# EAGLE schematic hashing.board (EAGLE 6.5.0)

## Sheet 1 of 4
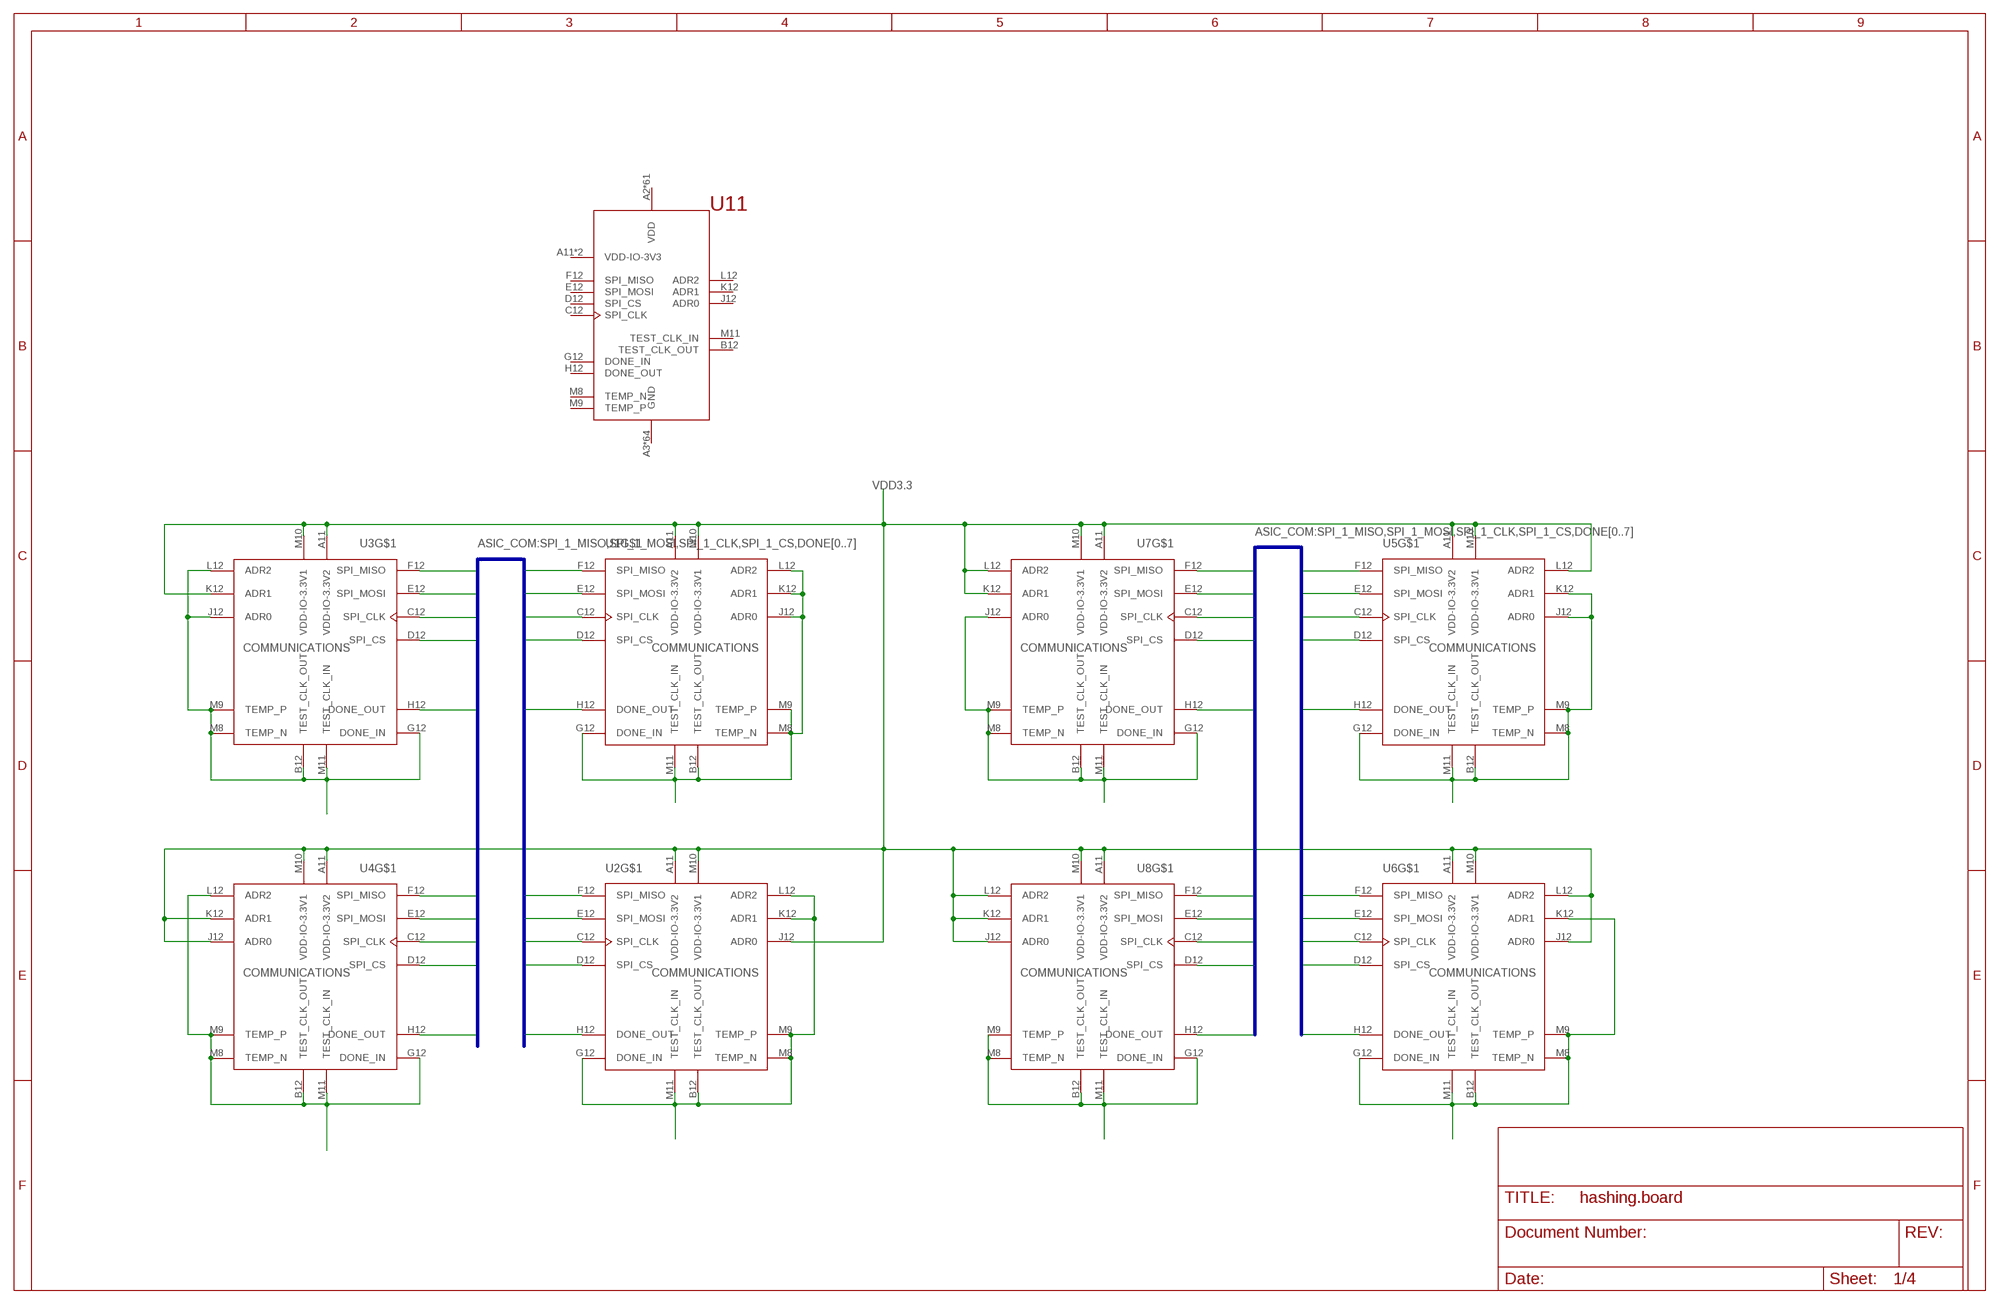
[diagram p0: schematic, sheet 1]

### Parts
U1  ASIC-1  [BGA-144-0.8MM]
U2  ASIC-1  [BGA-144-0.8MM]
U3  ASIC-1  [BGA-144-0.8MM]
U4  ASIC-1  [BGA-144-0.8MM]
U5  ASIC-1  [BGA-144-0.8MM]
U6  ASIC-1  [BGA-144-0.8MM]
U7  ASIC-1  [BGA-144-0.8MM]
U8  ASIC-1  [BGA-144-0.8MM]
U11  BFL-ASIC-1  [BFL-BGA-BIG-PADS]

### Nets
DONE0: U1.H12(DONE_OUT) ; also sheet 2
DONE1: U2.H12(DONE_OUT) ; also sheet 2
DONE2: U3.H12(DONE_OUT) ; also sheet 2
DONE3: U4.H12(DONE_OUT) ; also sheet 2
DONE4: U5.H12(DONE_OUT) ; also sheet 2
DONE5: U6.H12(DONE_OUT) ; also sheet 2
DONE6: U7.H12(DONE_OUT) ; also sheet 2
DONE7: U8.H12(DONE_OUT) ; also sheet 2
GND: U1.B12(TEST_CLK_OUT) U1.G12(DONE_IN) U1.J12(ADR0) U1.K12(ADR1) U1.L12(ADR2) U1.M8(TEMP_N) U1.M9(TEMP_P) U1.M11(TEST_CLK_IN) U2.B12(TEST_CLK_OUT) U2.G12(DONE_IN) U2.K12(ADR1) U2.L12(ADR2) U2.M8(TEMP_N) U2.M9(TEMP_P) U2.M11(TEST_CLK_IN) U3.B12(TEST_CLK_OUT) U3.G12(DONE_IN) U3.J12(ADR0) U3.L12(ADR2) U3.M8(TEMP_N) U3.M9(TEMP_P) U3.M11(TEST_CLK_IN) U4.B12(TEST_CLK_OUT) U4.G12(DONE_IN) U4.L12(ADR2) U4.M8(TEMP_N) U4.M9(TEMP_P) U4.M11(TEST_CLK_IN) U5.B12(TEST_CLK_OUT) U5.G12(DONE_IN) U5.J12(ADR0) U5.K12(ADR1) U5.M8(TEMP_N) U5.M9(TEMP_P) U5.M11(TEST_CLK_IN) U6.B12(TEST_CLK_OUT) U6.G12(DONE_IN) U6.K12(ADR1) U6.M8(TEMP_N) U6.M9(TEMP_P) U6.M11(TEST_CLK_IN) U7.B12(TEST_CLK_OUT) U7.G12(DONE_IN) U7.J12(ADR0) U7.M8(TEMP_N) U7.M9(TEMP_P) U7.M11(TEST_CLK_IN) U8.B12(TEST_CLK_OUT) U8.G12(DONE_IN) U8.M8(TEMP_N) U8.M9(TEMP_P) U8.M11(TEST_CLK_IN) ; also sheet 2,3,4
SPI_1_CLK: U1.C12(SPI_CLK) U2.C12(SPI_CLK) U3.C12(SPI_CLK) U4.C12(SPI_CLK) U5.C12(SPI_CLK) U6.C12(SPI_CLK) U7.C12(SPI_CLK) U8.C12(SPI_CLK) ; also sheet 2
SPI_1_CS: U1.D12(SPI_CS) U2.D12(SPI_CS) U3.D12(SPI_CS) U4.D12(SPI_CS) U5.D12(SPI_CS) U6.D12(SPI_CS) U7.D12(SPI_CS) U8.D12(SPI_CS) ; also sheet 2
SPI_1_MISO: U1.F12(SPI_MISO) U2.F12(SPI_MISO) U3.F12(SPI_MISO) U4.F12(SPI_MISO) U5.F12(SPI_MISO) U6.F12(SPI_MISO) U7.F12(SPI_MISO) U8.F12(SPI_MISO) ; also sheet 2
SPI_1_MOSI: U1.E12(SPI_MOSI) U2.E12(SPI_MOSI) U3.E12(SPI_MOSI) U4.E12(SPI_MOSI) U5.E12(SPI_MOSI) U6.E12(SPI_MOSI) U7.E12(SPI_MOSI) U8.E12(SPI_MOSI) ; also sheet 2
VDD3.3: U1.A11(VDD-IO-3.3V2) U1.M10(VDD-IO-3.3V1) U2.A11(VDD-IO-3.3V2) U2.J12(ADR0) U2.M10(VDD-IO-3.3V1) U3.A11(VDD-IO-3.3V2) U3.K12(ADR1) U3.M10(VDD-IO-3.3V1) U4.A11(VDD-IO-3.3V2) U4.J12(ADR0) U4.K12(ADR1) U4.M10(VDD-IO-3.3V1) U5.A11(VDD-IO-3.3V2) U5.L12(ADR2) U5.M10(VDD-IO-3.3V1) U6.A11(VDD-IO-3.3V2) U6.J12(ADR0) U6.L12(ADR2) U6.M10(VDD-IO-3.3V1) U7.A11(VDD-IO-3.3V2) U7.K12(ADR1) U7.L12(ADR2) U7.M10(VDD-IO-3.3V1) U8.A11(VDD-IO-3.3V2) U8.J12(ADR0) U8.K12(ADR1) U8.L12(ADR2) U8.M10(VDD-IO-3.3V1)
Unconnected: U11.B12(TEST_CLK_OUT) U11.C12(SPI_CLK) U11.D12(SPI_CS) U11.E12(SPI_MOSI) U11.F12(SPI_MISO) U11.G12(DONE_IN) U11.H12(DONE_OUT) U11.J12(ADR0) U11.K12(ADR1) U11.L12(ADR2) U11.M8(TEMP_N) U11.M9(TEMP_P) U11.M11(TEST_CLK_IN)

### Buses
ASIC_COM:SPI_1_MISO,SPI_1_MOSI,SPI_1_CLK,SPI_1_CS,DONE[0..7]

## Sheet 2 of 4
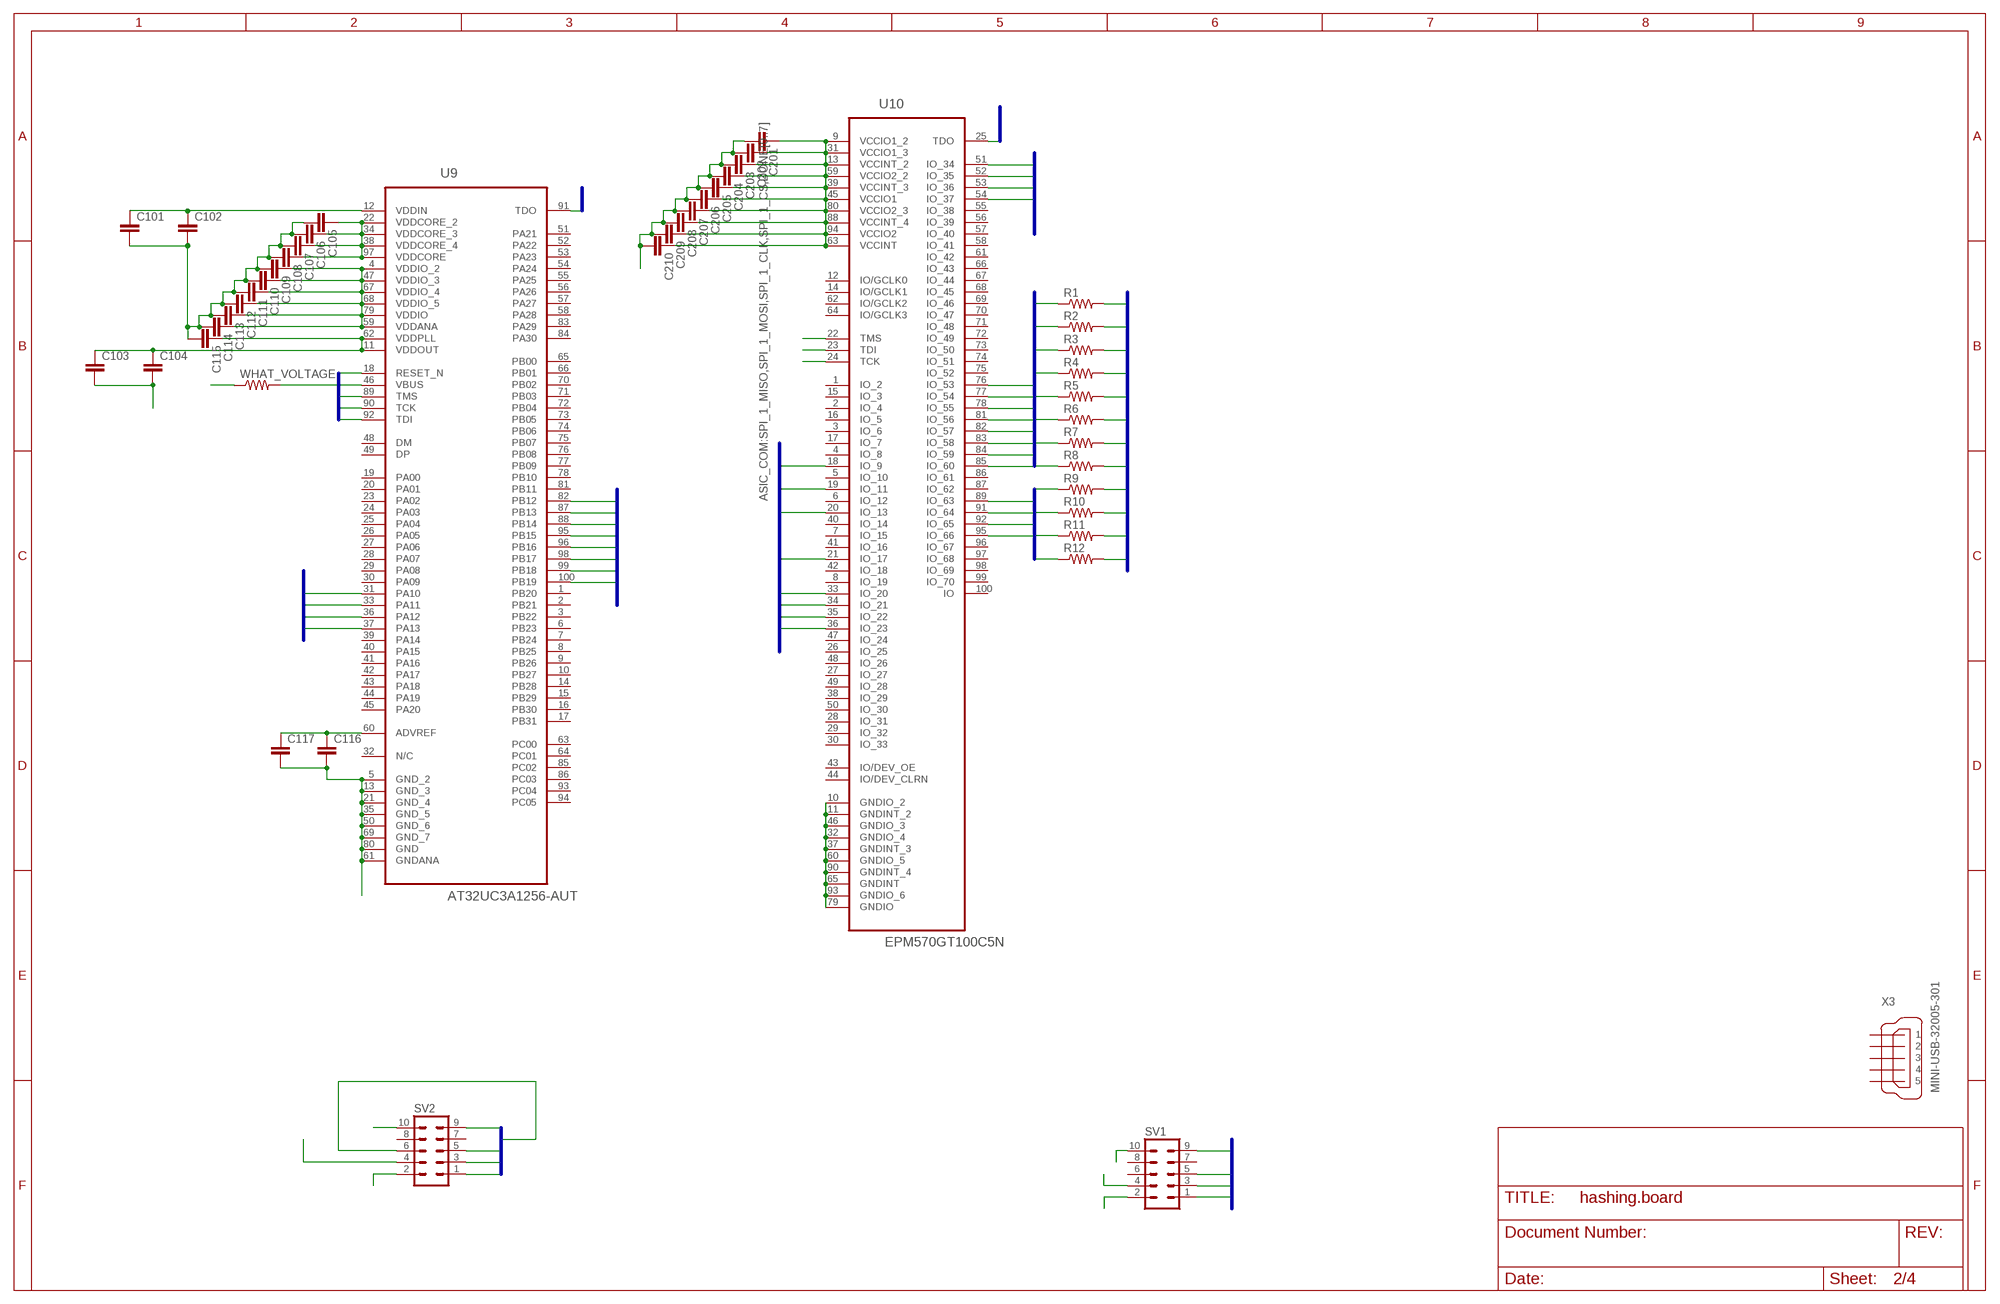
[diagram p1: schematic, sheet 2]

### Parts
C101  C-EUC0402  [C0402]
C102  C-EUC0402  [C0402]
C103  C-EUC0402  [C0402]
C104  C-EUC0402  [C0402]
C105  C-EUC0402  [C0402]
C106  C-EUC0402  [C0402]
C107  C-EUC0402  [C0402]
C108  C-EUC0402  [C0402]
C109  C-EUC0402  [C0402]
C110  C-EUC0402  [C0402]
C111  C-EUC0402  [C0402]
C112  C-EUC0402  [C0402]
C113  C-EUC0402  [C0402]
C114  C-EUC0402  [C0402]
C115  C-EUC0402  [C0402]
C116  C-EUC0402  [C0402]
C117  C-EUC0402  [C0402]
C201  C-EUC0402  [C0402]
C202  C-EUC0402  [C0402]
C203  C-EUC0402  [C0402]
C204  C-EUC0402  [C0402]
C205  C-EUC0402  [C0402]
C206  C-EUC0402  [C0402]
C207  C-EUC0402  [C0402]
C208  C-EUC0402  [C0402]
C209  C-EUC0402  [C0402]
C210  C-EUC0402  [C0402]
R1  R-US_R0201  [R0201]
R2  R-US_R0201  [R0201]
R3  R-US_R0201  [R0201]
R4  R-US_R0201  [R0201]
R5  R-US_R0201  [R0201]
R6  R-US_R0201  [R0201]
R7  R-US_R0201  [R0201]
R8  R-US_R0201  [R0201]
R9  R-US_R0201  [R0201]
R10  R-US_R0201  [R0201]
R11  R-US_R0201  [R0201]
R12  R-US_R0201  [R0201]
SV1  MA05-2  [MA05-2]
SV2  MA05-2  [MA05-2]
U9  AT32UC3A1256-AUT  [QFP50P1600X1600X120-100N]
U10  EPM570GT100C5N  [QFP50P1600X1600X120-100N]
WHAT_VOLTAGE  R-US_R0402  [R0402]
X3  MINI-USB-32005-301  [32005-301]

### Nets
ATMEL_RST: SV2.6 U9.18(RESET_N)
ATMEL_TCK: SV2.1 U9.90(TCK)
ATMEL_TDI: SV2.9 U9.92(TDI)
ATMEL_TDO: SV2.3 U9.91(TDO)
ATMEL_TMS: SV2.5 U9.89(TMS)
CHECK_HERE: WHAT_VOLTAGE.1
CHECK_VOLTAGE: U9.46(VBUS) WHAT_VOLTAGE.2
CPLD_TCK: SV1.1 U10.24(TCK)
CPLD_TDI: SV1.9 U10.23(TDI)
CPLD_TDO: SV1.3 U10.25(TDO)
CPLD_TMS: SV1.5 U10.22(TMS)
DONE0: R1.2 U10.18(IO_9) ; also sheet 1
DONE1: R2.2 U10.19(IO_11) ; also sheet 1
DONE2: R3.2 U10.20(IO_13) ; also sheet 1
DONE3: R4.2 U10.21(IO_17) ; also sheet 1
DONE4: R5.2 U10.51(IO_34) ; also sheet 1
DONE5: R6.2 U10.52(IO_35) ; also sheet 1
DONE6: R7.2 U10.53(IO_36) ; also sheet 1
DONE7: R8.2 U10.54(IO_37) ; also sheet 1
DONE_0: R1.1 U9.82(PB12) U10.76(IO_53)
DONE_1: R2.1 U9.87(PB13) U10.77(IO_54)
DONE_2: R3.1 U9.88(PB14) U10.78(IO_55)
DONE_3: R4.1 U9.95(PB15) U10.81(IO_56)
DONE_4: R5.1 U9.96(PB16) U10.82(IO_57)
DONE_5: R6.1 U9.98(PB17) U10.83(IO_58)
DONE_6: R7.1 U9.99(PB18) U10.84(IO_59)
DONE_7: R8.1 U9.100(PB19) U10.85(IO_60)
GND: C101.2 C102.2 C103.2 C104.2 C105.2 C106.2 C107.2 C108.2 C109.2 C110.2 C111.2 C112.2 C113.2 C114.2 C115.2 C116.2 C117.2 C201.2 C202.2 C203.2 C204.2 C205.2 C206.2 C207.2 C208.2 C209.2 C210.2 SV1.2 SV1.10 SV2.2 SV2.10 U9.5(GND_2) U9.13(GND_3) U9.21(GND_4) U9.35(GND_5) U9.50(GND_6) U9.61(GNDANA) U9.69(GND_7) U9.80(GND) U10.10(GNDIO_2) U10.11(GNDINT_2) U10.32(GNDIO_4) U10.37(GNDINT_3) U10.46(GNDIO_3) U10.60(GNDIO_5) U10.65(GNDINT) U10.79(GNDIO) U10.90(GNDINT_4) U10.93(GNDIO_6) ; also sheet 1,3,4
SPI_1_CLK: R11.2 U10.35(IO_22) ; also sheet 1
SPI_1_CLK_: R11.1 U9.37(PA13) U10.89(IO_63)
SPI_1_CS: R12.2 U10.36(IO_23) ; also sheet 1
SPI_1_CS_: R12.1 U9.31(PA10) U10.95(IO_66)
SPI_1_MISO: R9.2 U10.33(IO_20) ; also sheet 1
SPI_1_MISO_: R9.1 U9.33(PA11) U10.92(IO_65)
SPI_1_MOSI: R10.2 U10.34(IO_21) ; also sheet 1
SPI_1_MOSI_: R10.1 U9.36(PA12) U10.91(IO_64)
VCC+1V8: C103.1 C104.1 C105.1 C106.1 C107.1 C108.1 C115.1 U9.11(VDDOUT) U9.22(VDDCORE_2) U9.34(VDDCORE_3) U9.38(VDDCORE_4) U9.62(VDDPLL) U9.97(VDDCORE)
VCC+3V3: C101.1 C102.1 C109.1 C110.1 C111.1 C112.1 C113.1 C114.1 C116.1 C117.1 C201.1 C202.1 C203.1 C204.1 C205.1 C206.1 C207.1 C208.1 C209.1 C210.1 SV1.4 SV2.4 U9.4(VDDIO_2) U9.12(VDDIN) U9.47(VDDIO_3) U9.59(VDDANA) U9.60(ADVREF) U9.67(VDDIO_4) U9.68(VDDIO_5) U9.79(VDDIO) U10.9(VCCIO1_2) U10.13(VCCINT_2) U10.31(VCCIO1_3) U10.39(VCCINT_3) U10.45(VCCIO1) U10.59(VCCIO2_2) U10.63(VCCINT) U10.80(VCCIO2_3) U10.88(VCCINT_4) U10.94(VCCIO2)
Unconnected: SV1.6 SV1.7 SV1.8 SV2.7 SV2.8 U9.1(PB20) U9.2(PB21) U9.3(PB22) U9.6(PB23) U9.7(PB24) U9.8(PB25) U9.9(PB26) U9.10(PB27) U9.14(PB28) U9.15(PB29) U9.16(PB30) U9.17(PB31) U9.19(PA00) U9.20(PA01) U9.23(PA02) U9.24(PA03) U9.25(PA04) U9.26(PA05) U9.27(PA06) U9.28(PA07) U9.29(PA08) U9.30(PA09) U9.32(N/C) U9.39(PA14) U9.40(PA15) U9.41(PA16) U9.42(PA17) U9.43(PA18) U9.44(PA19) U9.45(PA20) U9.48(DM) U9.49(DP) U9.51(PA21) U9.52(PA22) U9.53(PA23) U9.54(PA24) U9.55(PA25) U9.56(PA26) U9.57(PA27) U9.58(PA28) U9.63(PC00) U9.64(PC01) U9.65(PB00) U9.66(PB01) U9.70(PB02) U9.71(PB03) U9.72(PB04) U9.73(PB05) U9.74(PB06) U9.75(PB07) U9.76(PB08) U9.77(PB09) U9.78(PB10) U9.81(PB11) U9.83(PA29) U9.84(PA30) U9.85(PC02) U9.86(PC03) U9.93(PC04) U9.94(PC05) U10.1(IO_2) U10.2(IO_4) U10.3(IO_6) U10.4(IO_8) U10.5(IO_10) U10.6(IO_12) U10.7(IO_15) U10.8(IO_19) U10.12(IO/GCLK0) U10.14(IO/GCLK1) U10.15(IO_3) U10.16(IO_5) U10.17(IO_7) U10.26(IO_25) U10.27(IO_27) U10.28(IO_31) U10.29(IO_32) U10.30(IO_33) U10.38(IO_29) U10.40(IO_14) U10.41(IO_16) U10.42(IO_18) U10.43(IO/DEV_OE) U10.44(IO/DEV_CLRN) U10.47(IO_24) U10.48(IO_26) U10.49(IO_28) U10.50(IO_30) U10.55(IO_38) U10.56(IO_39) U10.57(IO_40) U10.58(IO_41) U10.61(IO_42) U10.62(IO/GCLK2) U10.64(IO/GCLK3) U10.66(IO_43) U10.67(IO_44) U10.68(IO_45) U10.69(IO_46) U10.70(IO_47) U10.71(IO_48) U10.72(IO_49) U10.73(IO_50) U10.74(IO_51) U10.75(IO_52) U10.86(IO_61) U10.87(IO_62) U10.96(IO_67) U10.97(IO_68) U10.98(IO_69) U10.99(IO_70) U10.100(IO) X3.1 X3.2 X3.3 X3.4 X3.5

### Buses
ASIC_COM:SPI_1_MISO,SPI_1_MOSI,SPI_1_CLK,SPI_1_CS,DONE[0..7]
CPLD_COM:SPI_1_MISO_,SPI_1_MOSI_,SPI_1_CLK_,SPI_1_CS_,DONE_[0..7]
CPLD_OUTPUT:DONE_[0..7]
CPLD_JTAG:CPLD_TMS,CPLD_TDI,CPLD_TCK,CPLD_TDO
ATMEL_JTAG:ATMEL_TMS,ATMEL_TDI,ATMEL_TCK,ATMEL_TDO,ATMEL_RST

## Sheet 3 of 4
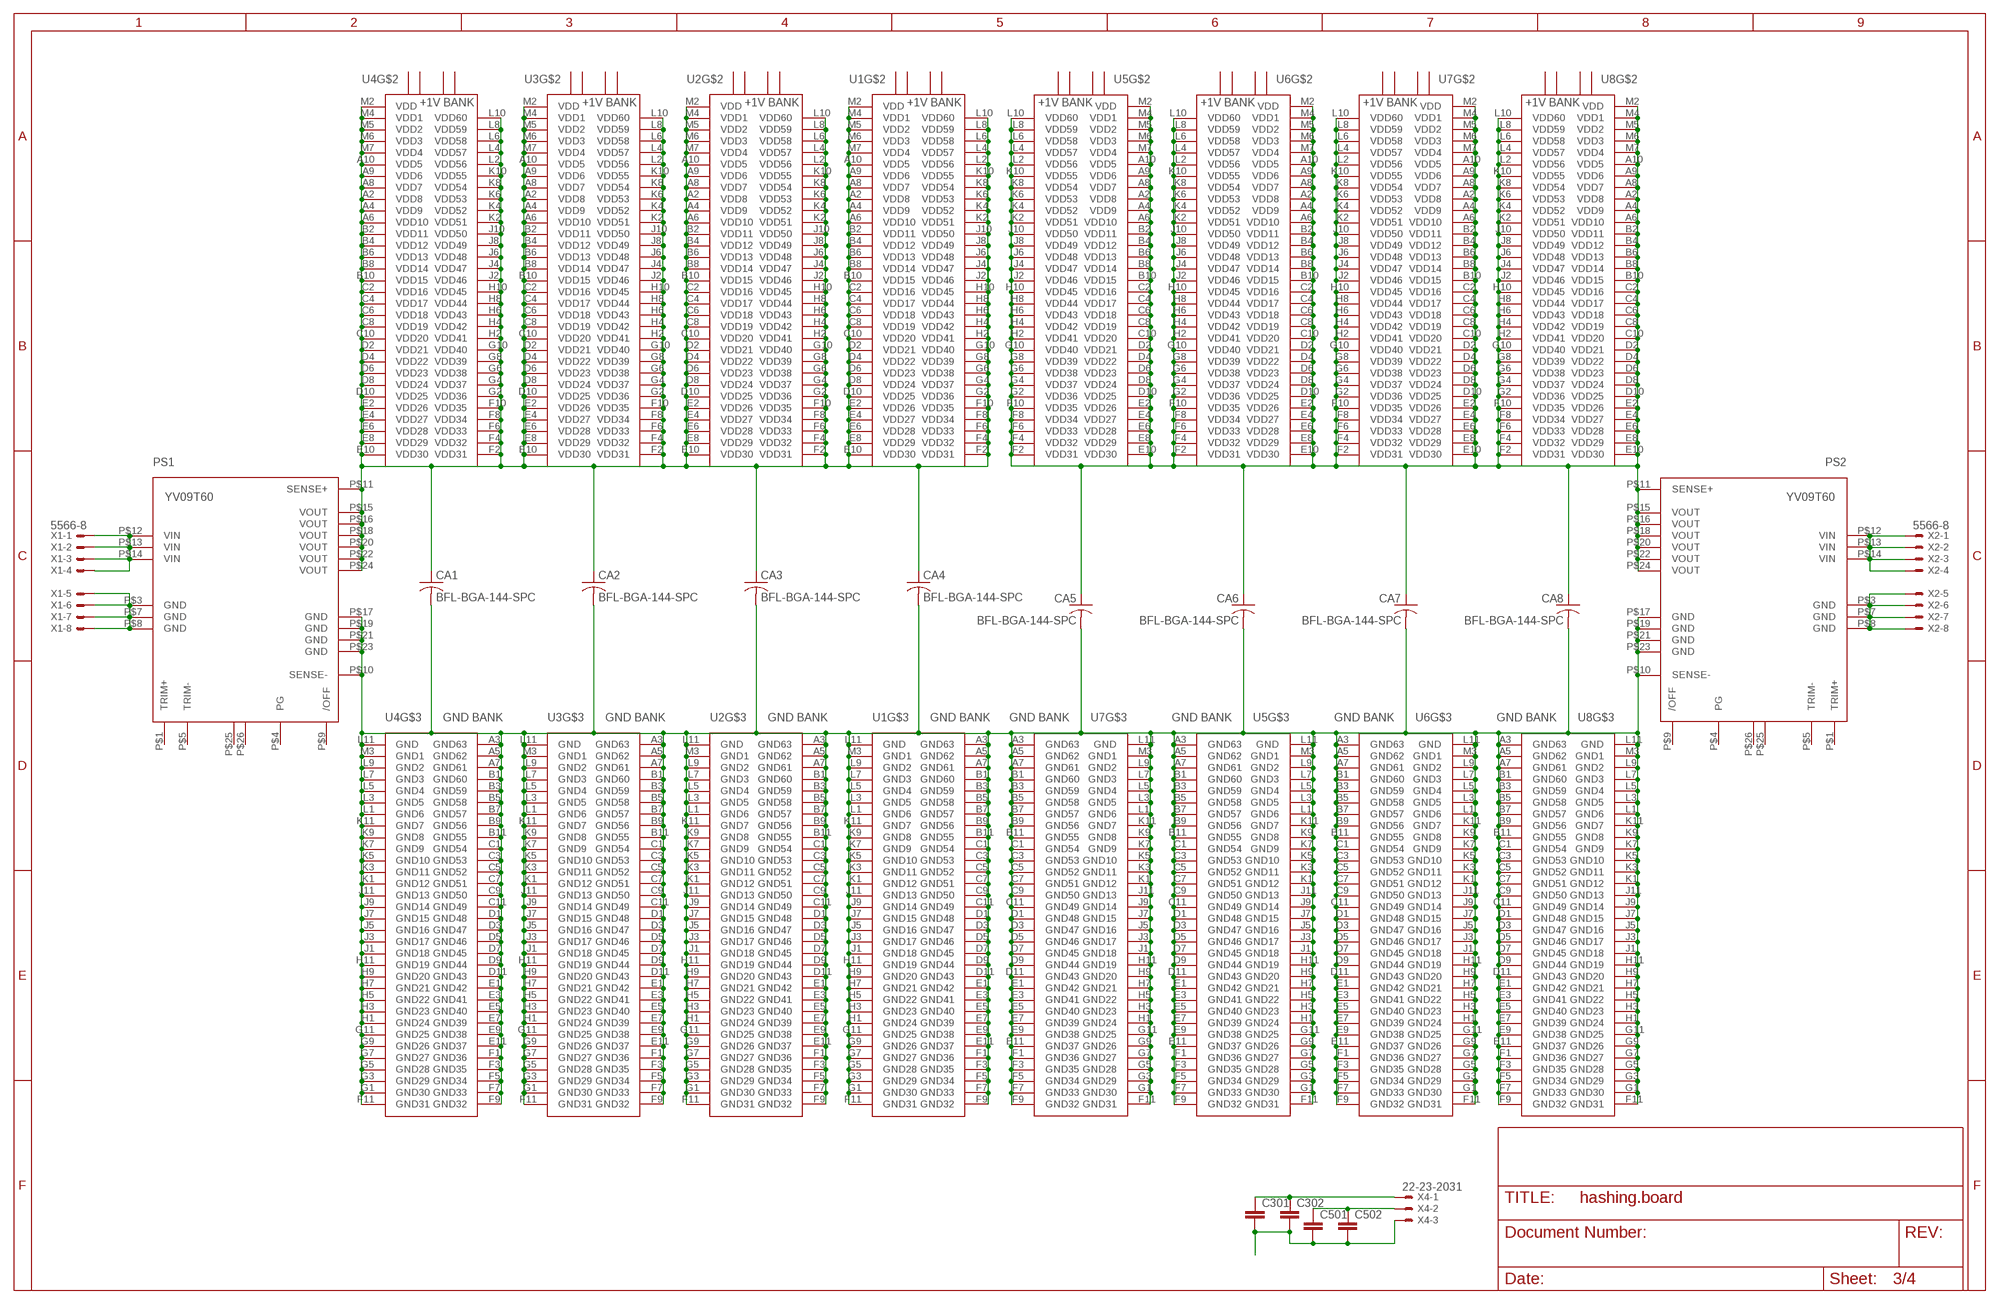
[diagram p2: schematic, sheet 3]

### Parts
C301  C-EUC0805K  [C0805K]
C302  C-EUC1210K  [C1210K]
C501  C-EUC0805K  [C0805K]
C502  C-EUC1210K  [C1210K]
CA1  BFL-BGA-144-SPC  [BFL-BGA-VIA-PATTERN]
CA2  BFL-BGA-144-SPC  [BFL-BGA-VIA-PATTERN]
CA3  BFL-BGA-144-SPC  [BFL-BGA-VIA-PATTERN]
CA4  BFL-BGA-144-SPC  [BFL-BGA-VIA-PATTERN]
CA5  BFL-BGA-144-SPC  [BFL-BGA-VIA-PATTERN]
CA6  BFL-BGA-144-SPC  [BFL-BGA-VIA-PATTERN]
CA7  BFL-BGA-144-SPC  [BFL-BGA-VIA-PATTERN]
CA8  BFL-BGA-144-SPC  [BFL-BGA-VIA-PATTERN]
PS1  YV09T60  [YV09T60]
PS2  YV09T60  [YV09T60]
X1  5566-8  [5566-8]
X2  5566-8  [5566-8]
X4  22-23-2031  [22-23-2031]

### Nets
GND: C301.2 C302.2 C501.2 C502.2 CA1.N$2 CA1.N$3 CA1.N$5 CA1.N$6 CA1.N$8 CA1.N$9 CA1.N$11 CA1.N$12 CA1.N$14 CA1.N$15 CA1.N$16 CA1.N$17 CA1.N$19 CA1.N$21 CA1.N$23 CA1.N$25 CA1.N$27 CA1.N$28 CA1.N$30 CA1.N$31 CA1.N$33 CA1.N$34 CA1.N$36 CA1.N$37 CA1.N$39 CA1.N$40 CA1.N$42 CA1.N$43 CA1.N$44 CA1.N$45 CA1.N$55 CA1.N$62 CA1.N$64 CA1.N$66 CA1.N$68 CA1.N$70 CA1.N$72 CA1.N$74 CA1.N$76 CA1.N$78 CA1.N$80 CA1.N$82 CA1.N$84 CA1.N$86 CA1.N$88 CA1.N$90 CA1.N$92 CA1.N$94 CA1.N$98 CA1.N$100 CA1.N$102 CA1.N$104 CA1.N$106 CA1.N$110 CA2.N$2 CA2.N$3 CA2.N$5 CA2.N$6 CA2.N$8 CA2.N$9 CA2.N$11 CA2.N$12 CA2.N$14 CA2.N$15 CA2.N$16 CA2.N$17 CA2.N$19 CA2.N$21 CA2.N$23 CA2.N$25 CA2.N$27 CA2.N$28 CA2.N$30 CA2.N$31 CA2.N$33 CA2.N$34 CA2.N$36 CA2.N$37 CA2.N$39 CA2.N$40 CA2.N$42 CA2.N$43 CA2.N$44 CA2.N$45 CA2.N$55 CA2.N$62 CA2.N$64 CA2.N$66 CA2.N$68 CA2.N$70 CA2.N$72 CA2.N$74 CA2.N$76 CA2.N$78 CA2.N$80 CA2.N$82 CA2.N$84 CA2.N$86 CA2.N$88 CA2.N$90 CA2.N$92 CA2.N$94 CA2.N$98 CA2.N$100 CA2.N$102 CA2.N$104 CA2.N$106 CA2.N$110 CA3.N$2 CA3.N$3 CA3.N$5 CA3.N$6 CA3.N$8 CA3.N$9 CA3.N$11 CA3.N$12 CA3.N$14 CA3.N$15 CA3.N$16 CA3.N$17 CA3.N$19 CA3.N$21 CA3.N$23 CA3.N$25 CA3.N$27 CA3.N$28 CA3.N$30 CA3.N$31 CA3.N$33 CA3.N$34 CA3.N$36 CA3.N$37 CA3.N$39 CA3.N$40 CA3.N$42 CA3.N$43 CA3.N$44 CA3.N$45 CA3.N$55 CA3.N$62 CA3.N$64 CA3.N$66 CA3.N$68 CA3.N$70 CA3.N$72 CA3.N$74 CA3.N$76 CA3.N$78 CA3.N$80 CA3.N$82 CA3.N$84 CA3.N$86 CA3.N$88 CA3.N$90 CA3.N$92 CA3.N$94 CA3.N$98 CA3.N$100 CA3.N$102 CA3.N$104 CA3.N$106 CA3.N$110 CA4.N$2 CA4.N$3 CA4.N$5 CA4.N$6 CA4.N$8 CA4.N$9 CA4.N$11 CA4.N$12 CA4.N$14 CA4.N$15 CA4.N$16 CA4.N$17 CA4.N$19 CA4.N$21 CA4.N$23 CA4.N$25 CA4.N$27 CA4.N$28 CA4.N$30 CA4.N$31 CA4.N$33 CA4.N$34 CA4.N$36 CA4.N$37 CA4.N$39 CA4.N$40 CA4.N$42 CA4.N$43 CA4.N$44 CA4.N$45 CA4.N$55 CA4.N$62 CA4.N$64 CA4.N$66 CA4.N$68 CA4.N$70 CA4.N$72 CA4.N$74 CA4.N$76 CA4.N$78 CA4.N$80 CA4.N$82 CA4.N$84 CA4.N$86 CA4.N$88 CA4.N$90 CA4.N$92 CA4.N$94 CA4.N$98 CA4.N$100 CA4.N$102 CA4.N$104 CA4.N$106 CA4.N$110 CA5.N$2 CA5.N$3 CA5.N$5 CA5.N$6 CA5.N$8 CA5.N$9 CA5.N$11 CA5.N$12 CA5.N$14 CA5.N$15 CA5.N$16 CA5.N$17 CA5.N$19 CA5.N$21 CA5.N$23 CA5.N$25 CA5.N$27 CA5.N$28 CA5.N$30 CA5.N$31 CA5.N$33 CA5.N$34 CA5.N$36 CA5.N$37 CA5.N$39 CA5.N$40 CA5.N$42 CA5.N$43 CA5.N$44 CA5.N$45 CA5.N$55 CA5.N$62 CA5.N$64 CA5.N$66 CA5.N$68 CA5.N$70 CA5.N$72 CA5.N$74 CA5.N$76 CA5.N$78 CA5.N$80 CA5.N$82 CA5.N$84 CA5.N$86 CA5.N$88 CA5.N$90 CA5.N$92 CA5.N$94 CA5.N$98 CA5.N$100 CA5.N$102 CA5.N$104 CA5.N$106 CA5.N$110 CA6.N$2 CA6.N$3 CA6.N$5 CA6.N$6 CA6.N$8 CA6.N$9 CA6.N$11 CA6.N$12 CA6.N$14 CA6.N$15 CA6.N$16 CA6.N$17 CA6.N$19 CA6.N$21 CA6.N$23 CA6.N$25 CA6.N$27 CA6.N$28 CA6.N$30 CA6.N$31 CA6.N$33 CA6.N$34 CA6.N$36 CA6.N$37 CA6.N$39 CA6.N$40 CA6.N$42 CA6.N$43 CA6.N$44 CA6.N$45 CA6.N$55 CA6.N$62 CA6.N$64 CA6.N$66 CA6.N$68 CA6.N$70 CA6.N$72 CA6.N$74 CA6.N$76 CA6.N$78 CA6.N$80 CA6.N$82 CA6.N$84 CA6.N$86 CA6.N$88 CA6.N$90 CA6.N$92 CA6.N$94 CA6.N$98 CA6.N$100 CA6.N$102 CA6.N$104 CA6.N$106 CA6.N$110 CA7.N$2 CA7.N$3 CA7.N$5 CA7.N$6 CA7.N$8 CA7.N$9 CA7.N$11 CA7.N$12 CA7.N$14 CA7.N$15 CA7.N$16 CA7.N$17 CA7.N$19 CA7.N$21 CA7.N$23 CA7.N$25 CA7.N$27 CA7.N$28 CA7.N$30 CA7.N$31 CA7.N$33 CA7.N$34 CA7.N$36 CA7.N$37 CA7.N$39 CA7.N$40 CA7.N$42 CA7.N$43 CA7.N$44 CA7.N$45 CA7.N$55 CA7.N$62 CA7.N$64 CA7.N$66 CA7.N$68 CA7.N$70 CA7.N$72 CA7.N$74 CA7.N$76 CA7.N$78 CA7.N$80 CA7.N$82 CA7.N$84 CA7.N$86 CA7.N$88 CA7.N$90 CA7.N$92 CA7.N$94 CA7.N$98 CA7.N$100 CA7.N$102 CA7.N$104 CA7.N$106 CA7.N$110 CA8.N$2 CA8.N$3 CA8.N$5 CA8.N$6 CA8.N$8 CA8.N$9 CA8.N$11 CA8.N$12 CA8.N$14 CA8.N$15 CA8.N$16 CA8.N$17 CA8.N$19 CA8.N$21 CA8.N$23 CA8.N$25 CA8.N$27 CA8.N$28 CA8.N$30 CA8.N$31 CA8.N$33 CA8.N$34 CA8.N$36 CA8.N$37 CA8.N$39 CA8.N$40 CA8.N$42 CA8.N$43 CA8.N$44 CA8.N$45 CA8.N$55 CA8.N$62 CA8.N$64 CA8.N$66 CA8.N$68 CA8.N$70 CA8.N$72 CA8.N$74 CA8.N$76 CA8.N$78 CA8.N$80 CA8.N$82 CA8.N$84 CA8.N$86 CA8.N$88 CA8.N$90 CA8.N$92 CA8.N$94 CA8.N$98 CA8.N$100 CA8.N$102 CA8.N$104 CA8.N$106 CA8.N$110 PS1.P$3(GND) PS1.P$7(GND) PS1.P$8(GND) PS1.P$10(SENSE-) PS1.P$17(GND) PS1.P$19(GND) PS1.P$21(GND) PS1.P$23(GND) PS2.P$3(GND) PS2.P$7(GND) PS2.P$8(GND) PS2.P$10(SENSE-) PS2.P$17(GND) PS2.P$19(GND) PS2.P$21(GND) PS2.P$23(GND) U1.A3(GND63) U1.A5(GND62) U1.A7(GND61) U1.B1(GND60) U1.B3(GND59) U1.B5(GND58) U1.B7(GND57) U1.B9(GND56) U1.B11(GND55) U1.C1(GND54) U1.C3(GND53) U1.C5(GND52) U1.C7(GND51) U1.C9(GND50) U1.C11(GND49) U1.D1(GND48) U1.D3(GND47) U1.D5(GND46) U1.D7(GND45) U1.D9(GND44) U1.D11(GND43) U1.E1(GND42) U1.E3(GND41) U1.E5(GND40) U1.E7(GND39) U1.E9(GND38) U1.E11(GND37) U1.F1(GND36) U1.F3(GND35) U1.F5(GND34) U1.F7(GND33) U1.F9(GND32) U1.F11(GND31) U1.G1(GND30) U1.G3(GND29) U1.G5(GND28) U1.G7(GND27) U1.G9(GND26) U1.G11(GND25) U1.H1(GND24) U1.H3(GND23) U1.H5(GND22) U1.H7(GND21) U1.H9(GND20) U1.H11(GND19) U1.J1(GND18) U1.J3(GND17) U1.J5(GND16) U1.J7(GND15) U1.J9(GND14) U1.J11(GND13) U1.K1(GND12) U1.K3(GND11) U1.K5(GND10) U1.K7(GND9) U1.K9(GND8) U1.K11(GND7) U1.L1(GND6) U1.L3(GND5) U1.L5(GND4) U1.L7(GND3) U1.L9(GND2) U1.L11(GND) U1.M3(GND1) U2.A3(GND63) U2.A5(GND62) U2.A7(GND61) U2.B1(GND60) U2.B3(GND59) U2.B5(GND58) U2.B7(GND57) U2.B9(GND56) U2.B11(GND55) U2.C1(GND54) U2.C3(GND53) U2.C5(GND52) U2.C7(GND51) U2.C9(GND50) U2.C11(GND49) U2.D1(GND48) U2.D3(GND47) U2.D5(GND46) U2.D7(GND45) U2.D9(GND44) U2.D11(GND43) U2.E1(GND42) U2.E3(GND41) U2.E5(GND40) U2.E7(GND39) U2.E9(GND38) U2.E11(GND37) U2.F1(GND36) U2.F3(GND35) U2.F5(GND34) U2.F7(GND33) U2.F9(GND32) U2.F11(GND31) U2.G1(GND30) U2.G3(GND29) U2.G5(GND28) U2.G7(GND27) U2.G9(GND26) U2.G11(GND25) U2.H1(GND24) U2.H3(GND23) U2.H5(GND22) U2.H7(GND21) U2.H9(GND20) U2.H11(GND19) U2.J1(GND18) U2.J3(GND17) U2.J5(GND16) U2.J7(GND15) U2.J9(GND14) U2.J11(GND13) U2.K1(GND12) U2.K3(GND11) U2.K5(GND10) U2.K7(GND9) U2.K9(GND8) U2.K11(GND7) U2.L1(GND6) U2.L3(GND5) U2.L5(GND4) U2.L7(GND3) U2.L9(GND2) U2.L11(GND) U2.M3(GND1) U3.A3(GND63) U3.A5(GND62) U3.A7(GND61) U3.B1(GND60) U3.B3(GND59) U3.B5(GND58) U3.B7(GND57) U3.B9(GND56) U3.B11(GND55) U3.C1(GND54) U3.C3(GND53) U3.C5(GND52) U3.C7(GND51) U3.C9(GND50) U3.C11(GND49) U3.D1(GND48) U3.D3(GND47) U3.D5(GND46) U3.D7(GND45) U3.D9(GND44) U3.D11(GND43) U3.E1(GND42) U3.E3(GND41) U3.E5(GND40) U3.E7(GND39) U3.E9(GND38) U3.E11(GND37) U3.F1(GND36) U3.F3(GND35) U3.F5(GND34) U3.F7(GND33) U3.F9(GND32) U3.F11(GND31) U3.G1(GND30) U3.G3(GND29) U3.G5(GND28) U3.G7(GND27) U3.G9(GND26) U3.G11(GND25) U3.H1(GND24) U3.H3(GND23) U3.H5(GND22) U3.H7(GND21) U3.H9(GND20) U3.H11(GND19) U3.J1(GND18) U3.J3(GND17) U3.J5(GND16) U3.J7(GND15) U3.J9(GND14) U3.J11(GND13) U3.K1(GND12) U3.K3(GND11) U3.K5(GND10) U3.K7(GND9) U3.K9(GND8) U3.K11(GND7) U3.L1(GND6) U3.L3(GND5) U3.L5(GND4) U3.L7(GND3) U3.L9(GND2) U3.L11(GND) U3.M3(GND1) U4.A3(GND63) U4.A5(GND62) U4.A7(GND61) U4.B1(GND60) U4.B3(GND59) U4.B5(GND58) U4.B7(GND57) U4.B9(GND56) U4.B11(GND55) U4.C1(GND54) U4.C3(GND53) U4.C5(GND52) U4.C7(GND51) U4.C9(GND50) U4.C11(GND49) U4.D1(GND48) U4.D3(GND47) U4.D5(GND46) U4.D7(GND45) U4.D9(GND44) U4.D11(GND43) U4.E1(GND42) U4.E3(GND41) U4.E5(GND40) U4.E7(GND39) U4.E9(GND38) U4.E11(GND37) U4.F1(GND36) U4.F3(GND35) U4.F5(GND34) U4.F7(GND33) U4.F9(GND32) U4.F11(GND31) U4.G1(GND30) U4.G3(GND29) U4.G5(GND28) U4.G7(GND27) U4.G9(GND26) U4.G11(GND25) U4.H1(GND24) U4.H3(GND23) U4.H5(GND22) U4.H7(GND21) U4.H9(GND20) U4.H11(GND19) U4.J1(GND18) U4.J3(GND17) U4.J5(GND16) U4.J7(GND15) U4.J9(GND14) U4.J11(GND13) U4.K1(GND12) U4.K3(GND11) U4.K5(GND10) U4.K7(GND9) U4.K9(GND8) U4.K11(GND7) U4.L1(GND6) U4.L3(GND5) U4.L5(GND4) U4.L7(GND3) U4.L9(GND2) U4.L11(GND) U4.M3(GND1) U5.A3(GND63) U5.A5(GND62) U5.A7(GND61) U5.B1(GND60) U5.B3(GND59) U5.B5(GND58) U5.B7(GND57) U5.B9(GND56) U5.B11(GND55) U5.C1(GND54) U5.C3(GND53) U5.C5(GND52) U5.C7(GND51) U5.C9(GND50) U5.C11(GND49) U5.D1(GND48) U5.D3(GND47) U5.D5(GND46) U5.D7(GND45) U5.D9(GND44) U5.D11(GND43) U5.E1(GND42) U5.E3(GND41) U5.E5(GND40) U5.E7(GND39) U5.E9(GND38) U5.E11(GND37) U5.F1(GND36) U5.F3(GND35) U5.F5(GND34) U5.F7(GND33) U5.F9(GND32) U5.F11(GND31) U5.G1(GND30) U5.G3(GND29) U5.G5(GND28) U5.G7(GND27) U5.G9(GND26) U5.G11(GND25) U5.H1(GND24) U5.H3(GND23) U5.H5(GND22) U5.H7(GND21) U5.H9(GND20) U5.H11(GND19) U5.J1(GND18) U5.J3(GND17) U5.J5(GND16) U5.J7(GND15) U5.J9(GND14) U5.J11(GND13) U5.K1(GND12) U5.K3(GND11) U5.K5(GND10) U5.K7(GND9) U5.K9(GND8) U5.K11(GND7) U5.L1(GND6) U5.L3(GND5) U5.L5(GND4) U5.L7(GND3) U5.L9(GND2) U5.L11(GND) U5.M3(GND1) U6.A3(GND63) U6.A5(GND62) U6.A7(GND61) U6.B1(GND60) U6.B3(GND59) U6.B5(GND58) U6.B7(GND57) U6.B9(GND56) U6.B11(GND55) U6.C1(GND54) U6.C3(GND53) U6.C5(GND52) U6.C7(GND51) U6.C9(GND50) U6.C11(GND49) U6.D1(GND48) U6.D3(GND47) U6.D5(GND46) U6.D7(GND45) U6.D9(GND44) U6.D11(GND43) U6.E1(GND42) U6.E3(GND41) U6.E5(GND40) U6.E7(GND39) U6.E9(GND38) U6.E11(GND37) U6.F1(GND36) U6.F3(GND35) U6.F5(GND34) U6.F7(GND33) U6.F9(GND32) U6.F11(GND31) U6.G1(GND30) U6.G3(GND29) U6.G5(GND28) U6.G7(GND27) U6.G9(GND26) U6.G11(GND25) U6.H1(GND24) U6.H3(GND23) U6.H5(GND22) U6.H7(GND21) U6.H9(GND20) U6.H11(GND19) U6.J1(GND18) U6.J3(GND17) U6.J5(GND16) U6.J7(GND15) U6.J9(GND14) U6.J11(GND13) U6.K1(GND12) U6.K3(GND11) U6.K5(GND10) U6.K7(GND9) U6.K9(GND8) U6.K11(GND7) U6.L1(GND6) U6.L3(GND5) U6.L5(GND4) U6.L7(GND3) U6.L9(GND2) U6.L11(GND) U6.M3(GND1) U7.A3(GND63) U7.A5(GND62) U7.A7(GND61) U7.B1(GND60) U7.B3(GND59) U7.B5(GND58) U7.B7(GND57) U7.B9(GND56) U7.B11(GND55) U7.C1(GND54) U7.C3(GND53) U7.C5(GND52) U7.C7(GND51) U7.C9(GND50) U7.C11(GND49) U7.D1(GND48) U7.D3(GND47) U7.D5(GND46) U7.D7(GND45) U7.D9(GND44) U7.D11(GND43) U7.E1(GND42) U7.E3(GND41) U7.E5(GND40) U7.E7(GND39) U7.E9(GND38) U7.E11(GND37) U7.F1(GND36) U7.F3(GND35) U7.F5(GND34) U7.F7(GND33) U7.F9(GND32) U7.F11(GND31) U7.G1(GND30) U7.G3(GND29) U7.G5(GND28) U7.G7(GND27) U7.G9(GND26) U7.G11(GND25) U7.H1(GND24) U7.H3(GND23) U7.H5(GND22) U7.H7(GND21) U7.H9(GND20) U7.H11(GND19) U7.J1(GND18) U7.J3(GND17) U7.J5(GND16) U7.J7(GND15) U7.J9(GND14) U7.J11(GND13) U7.K1(GND12) U7.K3(GND11) U7.K5(GND10) U7.K7(GND9) U7.K9(GND8) U7.K11(GND7) U7.L1(GND6) U7.L3(GND5) U7.L5(GND4) U7.L7(GND3) U7.L9(GND2) U7.L11(GND) U7.M3(GND1) U8.A3(GND63) U8.A5(GND62) U8.A7(GND61) U8.B1(GND60) U8.B3(GND59) U8.B5(GND58) U8.B7(GND57) U8.B9(GND56) U8.B11(GND55) U8.C1(GND54) U8.C3(GND53) U8.C5(GND52) U8.C7(GND51) U8.C9(GND50) U8.C11(GND49) U8.D1(GND48) U8.D3(GND47) U8.D5(GND46) U8.D7(GND45) U8.D9(GND44) U8.D11(GND43) U8.E1(GND42) U8.E3(GND41) U8.E5(GND40) U8.E7(GND39) U8.E9(GND38) U8.E11(GND37) U8.F1(GND36) U8.F3(GND35) U8.F5(GND34) U8.F7(GND33) U8.F9(GND32) U8.F11(GND31) U8.G1(GND30) U8.G3(GND29) U8.G5(GND28) U8.G7(GND27) U8.G9(GND26) U8.G11(GND25) U8.H1(GND24) U8.H3(GND23) U8.H5(GND22) U8.H7(GND21) U8.H9(GND20) U8.H11(GND19) U8.J1(GND18) U8.J3(GND17) U8.J5(GND16) U8.J7(GND15) U8.J9(GND14) U8.J11(GND13) U8.K1(GND12) U8.K3(GND11) U8.K5(GND10) U8.K7(GND9) U8.K9(GND8) U8.K11(GND7) U8.L1(GND6) U8.L3(GND5) U8.L5(GND4) U8.L7(GND3) U8.L9(GND2) U8.L11(GND) U8.M3(GND1) X1.5 X1.6 X1.7 X1.8 X2.5 X2.6 X2.7 X2.8 X4.3 ; also sheet 1,2,4
VDD-1VA: CA1.P$1 CA1.P$4 CA1.P$7 CA1.P$10 CA1.P$13 CA1.P$18 CA1.P$20 CA1.P$22 CA1.P$24 CA1.P$26 CA1.P$29 CA1.P$32 CA1.P$35 CA1.P$38 CA1.P$41 CA1.P$46 CA1.P$47 CA1.P$48 CA1.P$49 CA1.P$50 CA1.P$51 CA1.P$52 CA1.P$53 CA1.P$54 CA1.P$56 CA1.P$57 CA1.P$58 CA1.P$59 CA1.P$60 CA1.P$61 CA1.P$63 CA1.P$65 CA1.P$67 CA1.P$69 CA1.P$71 CA1.P$73 CA1.P$75 CA1.P$77 CA1.P$79 CA1.P$81 CA1.P$83 CA1.P$85 CA1.P$87 CA1.P$89 CA1.P$91 CA1.P$93 CA1.P$95 CA1.P$99 CA1.P$101 CA1.P$103 CA1.P$105 CA1.P$107 CA1.P$111 CA2.P$1 CA2.P$4 CA2.P$7 CA2.P$10 CA2.P$13 CA2.P$18 CA2.P$20 CA2.P$22 CA2.P$24 CA2.P$26 CA2.P$29 CA2.P$32 CA2.P$35 CA2.P$38 CA2.P$41 CA2.P$46 CA2.P$47 CA2.P$48 CA2.P$49 CA2.P$50 CA2.P$51 CA2.P$52 CA2.P$53 CA2.P$54 CA2.P$56 CA2.P$57 CA2.P$58 CA2.P$59 CA2.P$60 CA2.P$61 CA2.P$63 CA2.P$65 CA2.P$67 CA2.P$69 CA2.P$71 CA2.P$73 CA2.P$75 CA2.P$77 CA2.P$79 CA2.P$81 CA2.P$83 CA2.P$85 CA2.P$87 CA2.P$89 CA2.P$91 CA2.P$93 CA2.P$95 CA2.P$99 CA2.P$101 CA2.P$103 CA2.P$105 CA2.P$107 CA2.P$111 CA3.P$1 CA3.P$4 CA3.P$7 CA3.P$10 CA3.P$13 CA3.P$18 CA3.P$20 CA3.P$22 CA3.P$24 CA3.P$26 CA3.P$29 CA3.P$32 CA3.P$35 CA3.P$38 CA3.P$41 CA3.P$46 CA3.P$47 CA3.P$48 CA3.P$49 CA3.P$50 CA3.P$51 CA3.P$52 CA3.P$53 CA3.P$54 CA3.P$56 CA3.P$57 CA3.P$58 CA3.P$59 CA3.P$60 CA3.P$61 CA3.P$63 CA3.P$65 CA3.P$67 CA3.P$69 CA3.P$71 CA3.P$73 CA3.P$75 CA3.P$77 CA3.P$79 CA3.P$81 CA3.P$83 CA3.P$85 CA3.P$87 CA3.P$89 CA3.P$91 CA3.P$93 CA3.P$95 CA3.P$99 CA3.P$101 CA3.P$103 CA3.P$105 CA3.P$107 CA3.P$111 CA4.P$1 CA4.P$4 CA4.P$7 CA4.P$10 CA4.P$13 CA4.P$18 CA4.P$20 CA4.P$22 CA4.P$24 CA4.P$26 CA4.P$29 CA4.P$32 CA4.P$35 CA4.P$38 CA4.P$41 CA4.P$46 CA4.P$47 CA4.P$48 CA4.P$49 CA4.P$50 CA4.P$51 CA4.P$52 CA4.P$53 CA4.P$54 CA4.P$56 CA4.P$57 CA4.P$58 CA4.P$59 CA4.P$60 CA4.P$61 CA4.P$63 CA4.P$65 CA4.P$67 CA4.P$69 CA4.P$71 CA4.P$73 CA4.P$75 CA4.P$77 CA4.P$79 CA4.P$81 CA4.P$83 CA4.P$85 CA4.P$87 CA4.P$89 CA4.P$91 CA4.P$93 CA4.P$95 CA4.P$99 CA4.P$101 CA4.P$103 CA4.P$105 CA4.P$107 CA4.P$111 PS1.P$11(SENSE+) PS1.P$15(VOUT) PS1.P$16(VOUT) PS1.P$18(VOUT) PS1.P$20(VOUT) PS1.P$22(VOUT) PS1.P$24(VOUT) U1.A2(VDD8) U1.A4(VDD9) U1.A6(VDD10) U1.A8(VDD7) U1.A9(VDD6) U1.A10(VDD5) U1.B2(VDD11) U1.B4(VDD12) U1.B6(VDD13) U1.B8(VDD14) U1.B10(VDD15) U1.C2(VDD16) U1.C4(VDD17) U1.C6(VDD18) U1.C8(VDD19) U1.C10(VDD20) U1.D2(VDD21) U1.D4(VDD22) U1.D6(VDD23) U1.D8(VDD24) U1.D10(VDD25) U1.E2(VDD26) U1.E4(VDD27) U1.E6(VDD28) U1.E8(VDD29) U1.E10(VDD30) U1.F2(VDD31) U1.F4(VDD32) U1.F6(VDD33) U1.F8(VDD34) U1.F10(VDD35) U1.G2(VDD36) U1.G4(VDD37) U1.G6(VDD38) U1.G8(VDD39) U1.G10(VDD40) U1.H2(VDD41) U1.H4(VDD42) U1.H6(VDD43) U1.H8(VDD44) U1.H10(VDD45) U1.J2(VDD46) U1.J4(VDD47) U1.J6(VDD48) U1.J8(VDD49) U1.J10(VDD50) U1.K2(VDD51) U1.K4(VDD52) U1.K6(VDD53) U1.K8(VDD54) U1.K10(VDD55) U1.L2(VDD56) U1.L4(VDD57) U1.L6(VDD58) U1.L8(VDD59) U1.L10(VDD60) U1.M2(VDD) U1.M4(VDD1) U1.M5(VDD2) U1.M6(VDD3) U1.M7(VDD4) U2.A2(VDD8) U2.A4(VDD9) U2.A6(VDD10) U2.A8(VDD7) U2.A9(VDD6) U2.A10(VDD5) U2.B2(VDD11) U2.B4(VDD12) U2.B6(VDD13) U2.B8(VDD14) U2.B10(VDD15) U2.C2(VDD16) U2.C4(VDD17) U2.C6(VDD18) U2.C8(VDD19) U2.C10(VDD20) U2.D2(VDD21) U2.D4(VDD22) U2.D6(VDD23) U2.D8(VDD24) U2.D10(VDD25) U2.E2(VDD26) U2.E4(VDD27) U2.E6(VDD28) U2.E8(VDD29) U2.E10(VDD30) U2.F2(VDD31) U2.F4(VDD32) U2.F6(VDD33) U2.F8(VDD34) U2.F10(VDD35) U2.G2(VDD36) U2.G4(VDD37) U2.G6(VDD38) U2.G8(VDD39) U2.G10(VDD40) U2.H2(VDD41) U2.H4(VDD42) U2.H6(VDD43) U2.H8(VDD44) U2.H10(VDD45) U2.J2(VDD46) U2.J4(VDD47) U2.J6(VDD48) U2.J8(VDD49) U2.J10(VDD50) U2.K2(VDD51) U2.K4(VDD52) U2.K6(VDD53) U2.K8(VDD54) U2.K10(VDD55) U2.L2(VDD56) U2.L4(VDD57) U2.L6(VDD58) U2.L8(VDD59) U2.L10(VDD60) U2.M2(VDD) U2.M4(VDD1) U2.M5(VDD2) U2.M6(VDD3) U2.M7(VDD4) U3.A2(VDD8) U3.A4(VDD9) U3.A6(VDD10) U3.A8(VDD7) U3.A9(VDD6) U3.A10(VDD5) U3.B2(VDD11) U3.B4(VDD12) U3.B6(VDD13) U3.B8(VDD14) U3.B10(VDD15) U3.C2(VDD16) U3.C4(VDD17) U3.C6(VDD18) U3.C8(VDD19) U3.C10(VDD20) U3.D2(VDD21) U3.D4(VDD22) U3.D6(VDD23) U3.D8(VDD24) U3.D10(VDD25) U3.E2(VDD26) U3.E4(VDD27) U3.E6(VDD28) U3.E8(VDD29) U3.E10(VDD30) U3.F2(VDD31) U3.F4(VDD32) U3.F6(VDD33) U3.F8(VDD34) U3.F10(VDD35) U3.G2(VDD36) U3.G4(VDD37) U3.G6(VDD38) U3.G8(VDD39) U3.G10(VDD40) U3.H2(VDD41) U3.H4(VDD42) U3.H6(VDD43) U3.H8(VDD44) U3.H10(VDD45) U3.J2(VDD46) U3.J4(VDD47) U3.J6(VDD48) U3.J8(VDD49) U3.J10(VDD50) U3.K2(VDD51) U3.K4(VDD52) U3.K6(VDD53) U3.K8(VDD54) U3.K10(VDD55) U3.L2(VDD56) U3.L4(VDD57) U3.L6(VDD58) U3.L8(VDD59) U3.L10(VDD60) U3.M2(VDD) U3.M4(VDD1) U3.M5(VDD2) U3.M6(VDD3) U3.M7(VDD4) U4.A2(VDD8) U4.A4(VDD9) U4.A6(VDD10) U4.A8(VDD7) U4.A9(VDD6) U4.A10(VDD5) U4.B2(VDD11) U4.B4(VDD12) U4.B6(VDD13) U4.B8(VDD14) U4.B10(VDD15) U4.C2(VDD16) U4.C4(VDD17) U4.C6(VDD18) U4.C8(VDD19) U4.C10(VDD20) U4.D2(VDD21) U4.D4(VDD22) U4.D6(VDD23) U4.D8(VDD24) U4.D10(VDD25) U4.E2(VDD26) U4.E4(VDD27) U4.E6(VDD28) U4.E8(VDD29) U4.E10(VDD30) U4.F2(VDD31) U4.F4(VDD32) U4.F6(VDD33) U4.F8(VDD34) U4.F10(VDD35) U4.G2(VDD36) U4.G4(VDD37) U4.G6(VDD38) U4.G8(VDD39) U4.G10(VDD40) U4.H2(VDD41) U4.H4(VDD42) U4.H6(VDD43) U4.H8(VDD44) U4.H10(VDD45) U4.J2(VDD46) U4.J4(VDD47) U4.J6(VDD48) U4.J8(VDD49) U4.J10(VDD50) U4.K2(VDD51) U4.K4(VDD52) U4.K6(VDD53) U4.K8(VDD54) U4.K10(VDD55) U4.L2(VDD56) U4.L4(VDD57) U4.L6(VDD58) U4.L8(VDD59) U4.L10(VDD60) U4.M2(VDD) U4.M4(VDD1) U4.M5(VDD2) U4.M6(VDD3) U4.M7(VDD4) ; also sheet 4
VDD-1VB: CA5.P$1 CA5.P$4 CA5.P$7 CA5.P$10 CA5.P$13 CA5.P$18 CA5.P$20 CA5.P$22 CA5.P$24 CA5.P$26 CA5.P$29 CA5.P$32 CA5.P$35 CA5.P$38 CA5.P$41 CA5.P$46 CA5.P$47 CA5.P$48 CA5.P$49 CA5.P$50 CA5.P$51 CA5.P$52 CA5.P$53 CA5.P$54 CA5.P$56 CA5.P$57 CA5.P$58 CA5.P$59 CA5.P$60 CA5.P$61 CA5.P$63 CA5.P$65 CA5.P$67 CA5.P$69 CA5.P$71 CA5.P$73 CA5.P$75 CA5.P$77 CA5.P$79 CA5.P$81 CA5.P$83 CA5.P$85 CA5.P$87 CA5.P$89 CA5.P$91 CA5.P$93 CA5.P$95 CA5.P$99 CA5.P$101 CA5.P$103 CA5.P$105 CA5.P$107 CA5.P$111 CA6.P$1 CA6.P$4 CA6.P$7 CA6.P$10 CA6.P$13 CA6.P$18 CA6.P$20 CA6.P$22 CA6.P$24 CA6.P$26 CA6.P$29 CA6.P$32 CA6.P$35 CA6.P$38 CA6.P$41 CA6.P$46 CA6.P$47 CA6.P$48 CA6.P$49 CA6.P$50 CA6.P$51 CA6.P$52 CA6.P$53 CA6.P$54 CA6.P$56 CA6.P$57 CA6.P$58 CA6.P$59 CA6.P$60 CA6.P$61 CA6.P$63 CA6.P$65 CA6.P$67 CA6.P$69 CA6.P$71 CA6.P$73 CA6.P$75 CA6.P$77 CA6.P$79 CA6.P$81 CA6.P$83 CA6.P$85 CA6.P$87 CA6.P$89 CA6.P$91 CA6.P$93 CA6.P$95 CA6.P$99 CA6.P$101 CA6.P$103 CA6.P$105 CA6.P$107 CA6.P$111 CA7.P$1 CA7.P$4 CA7.P$7 CA7.P$10 CA7.P$13 CA7.P$18 CA7.P$20 CA7.P$22 CA7.P$24 CA7.P$26 CA7.P$29 CA7.P$32 CA7.P$35 CA7.P$38 CA7.P$41 CA7.P$46 CA7.P$47 CA7.P$48 CA7.P$49 CA7.P$50 CA7.P$51 CA7.P$52 CA7.P$53 CA7.P$54 CA7.P$56 CA7.P$57 CA7.P$58 CA7.P$59 CA7.P$60 CA7.P$61 CA7.P$63 CA7.P$65 CA7.P$67 CA7.P$69 CA7.P$71 CA7.P$73 CA7.P$75 CA7.P$77 CA7.P$79 CA7.P$81 CA7.P$83 CA7.P$85 CA7.P$87 CA7.P$89 CA7.P$91 CA7.P$93 CA7.P$95 CA7.P$99 CA7.P$101 CA7.P$103 CA7.P$105 CA7.P$107 CA7.P$111 CA8.P$1 CA8.P$4 CA8.P$7 CA8.P$10 CA8.P$13 CA8.P$18 CA8.P$20 CA8.P$22 CA8.P$24 CA8.P$26 CA8.P$29 CA8.P$32 CA8.P$35 CA8.P$38 CA8.P$41 CA8.P$46 CA8.P$47 CA8.P$48 CA8.P$49 CA8.P$50 CA8.P$51 CA8.P$52 CA8.P$53 CA8.P$54 CA8.P$56 CA8.P$57 CA8.P$58 CA8.P$59 CA8.P$60 CA8.P$61 CA8.P$63 CA8.P$65 CA8.P$67 CA8.P$69 CA8.P$71 CA8.P$73 CA8.P$75 CA8.P$77 CA8.P$79 CA8.P$81 CA8.P$83 CA8.P$85 CA8.P$87 CA8.P$89 CA8.P$91 CA8.P$93 CA8.P$95 CA8.P$99 CA8.P$101 CA8.P$103 CA8.P$105 CA8.P$107 CA8.P$111 PS2.P$11(SENSE+) PS2.P$15(VOUT) PS2.P$16(VOUT) PS2.P$18(VOUT) PS2.P$20(VOUT) PS2.P$22(VOUT) PS2.P$24(VOUT) U5.A2(VDD8) U5.A4(VDD9) U5.A6(VDD10) U5.A8(VDD7) U5.A9(VDD6) U5.A10(VDD5) U5.B2(VDD11) U5.B4(VDD12) U5.B6(VDD13) U5.B8(VDD14) U5.B10(VDD15) U5.C2(VDD16) U5.C4(VDD17) U5.C6(VDD18) U5.C8(VDD19) U5.C10(VDD20) U5.D2(VDD21) U5.D4(VDD22) U5.D6(VDD23) U5.D8(VDD24) U5.D10(VDD25) U5.E2(VDD26) U5.E4(VDD27) U5.E6(VDD28) U5.E8(VDD29) U5.E10(VDD30) U5.F2(VDD31) U5.F4(VDD32) U5.F6(VDD33) U5.F8(VDD34) U5.F10(VDD35) U5.G2(VDD36) U5.G4(VDD37) U5.G6(VDD38) U5.G8(VDD39) U5.G10(VDD40) U5.H2(VDD41) U5.H4(VDD42) U5.H6(VDD43) U5.H8(VDD44) U5.H10(VDD45) U5.J2(VDD46) U5.J4(VDD47) U5.J6(VDD48) U5.J8(VDD49) U5.J10(VDD50) U5.K2(VDD51) U5.K4(VDD52) U5.K6(VDD53) U5.K8(VDD54) U5.K10(VDD55) U5.L2(VDD56) U5.L4(VDD57) U5.L6(VDD58) U5.L8(VDD59) U5.L10(VDD60) U5.M2(VDD) U5.M4(VDD1) U5.M5(VDD2) U5.M6(VDD3) U5.M7(VDD4) U6.A2(VDD8) U6.A4(VDD9) U6.A6(VDD10) U6.A8(VDD7) U6.A9(VDD6) U6.A10(VDD5) U6.B2(VDD11) U6.B4(VDD12) U6.B6(VDD13) U6.B8(VDD14) U6.B10(VDD15) U6.C2(VDD16) U6.C4(VDD17) U6.C6(VDD18) U6.C8(VDD19) U6.C10(VDD20) U6.D2(VDD21) U6.D4(VDD22) U6.D6(VDD23) U6.D8(VDD24) U6.D10(VDD25) U6.E2(VDD26) U6.E4(VDD27) U6.E6(VDD28) U6.E8(VDD29) U6.E10(VDD30) U6.F2(VDD31) U6.F4(VDD32) U6.F6(VDD33) U6.F8(VDD34) U6.F10(VDD35) U6.G2(VDD36) U6.G4(VDD37) U6.G6(VDD38) U6.G8(VDD39) U6.G10(VDD40) U6.H2(VDD41) U6.H4(VDD42) U6.H6(VDD43) U6.H8(VDD44) U6.H10(VDD45) U6.J2(VDD46) U6.J4(VDD47) U6.J6(VDD48) U6.J8(VDD49) U6.J10(VDD50) U6.K2(VDD51) U6.K4(VDD52) U6.K6(VDD53) U6.K8(VDD54) U6.K10(VDD55) U6.L2(VDD56) U6.L4(VDD57) U6.L6(VDD58) U6.L8(VDD59) U6.L10(VDD60) U6.M2(VDD) U6.M4(VDD1) U6.M5(VDD2) U6.M6(VDD3) U6.M7(VDD4) U7.A2(VDD8) U7.A4(VDD9) U7.A6(VDD10) U7.A8(VDD7) U7.A9(VDD6) U7.A10(VDD5) U7.B2(VDD11) U7.B4(VDD12) U7.B6(VDD13) U7.B8(VDD14) U7.B10(VDD15) U7.C2(VDD16) U7.C4(VDD17) U7.C6(VDD18) U7.C8(VDD19) U7.C10(VDD20) U7.D2(VDD21) U7.D4(VDD22) U7.D6(VDD23) U7.D8(VDD24) U7.D10(VDD25) U7.E2(VDD26) U7.E4(VDD27) U7.E6(VDD28) U7.E8(VDD29) U7.E10(VDD30) U7.F2(VDD31) U7.F4(VDD32) U7.F6(VDD33) U7.F8(VDD34) U7.F10(VDD35) U7.G2(VDD36) U7.G4(VDD37) U7.G6(VDD38) U7.G8(VDD39) U7.G10(VDD40) U7.H2(VDD41) U7.H4(VDD42) U7.H6(VDD43) U7.H8(VDD44) U7.H10(VDD45) U7.J2(VDD46) U7.J4(VDD47) U7.J6(VDD48) U7.J8(VDD49) U7.J10(VDD50) U7.K2(VDD51) U7.K4(VDD52) U7.K6(VDD53) U7.K8(VDD54) U7.K10(VDD55) U7.L2(VDD56) U7.L4(VDD57) U7.L6(VDD58) U7.L8(VDD59) U7.L10(VDD60) U7.M2(VDD) U7.M4(VDD1) U7.M5(VDD2) U7.M6(VDD3) U7.M7(VDD4) U8.A2(VDD8) U8.A4(VDD9) U8.A6(VDD10) U8.A8(VDD7) U8.A9(VDD6) U8.A10(VDD5) U8.B2(VDD11) U8.B4(VDD12) U8.B6(VDD13) U8.B8(VDD14) U8.B10(VDD15) U8.C2(VDD16) U8.C4(VDD17) U8.C6(VDD18) U8.C8(VDD19) U8.C10(VDD20) U8.D2(VDD21) U8.D4(VDD22) U8.D6(VDD23) U8.D8(VDD24) U8.D10(VDD25) U8.E2(VDD26) U8.E4(VDD27) U8.E6(VDD28) U8.E8(VDD29) U8.E10(VDD30) U8.F2(VDD31) U8.F4(VDD32) U8.F6(VDD33) U8.F8(VDD34) U8.F10(VDD35) U8.G2(VDD36) U8.G4(VDD37) U8.G6(VDD38) U8.G8(VDD39) U8.G10(VDD40) U8.H2(VDD41) U8.H4(VDD42) U8.H6(VDD43) U8.H8(VDD44) U8.H10(VDD45) U8.J2(VDD46) U8.J4(VDD47) U8.J6(VDD48) U8.J8(VDD49) U8.J10(VDD50) U8.K2(VDD51) U8.K4(VDD52) U8.K6(VDD53) U8.K8(VDD54) U8.K10(VDD55) U8.L2(VDD56) U8.L4(VDD57) U8.L6(VDD58) U8.L8(VDD59) U8.L10(VDD60) U8.M2(VDD) U8.M4(VDD1) U8.M5(VDD2) U8.M6(VDD3) U8.M7(VDD4)
VIN1: PS1.P$12(VIN) PS1.P$13(VIN) PS1.P$14(VIN) X1.1 X1.2 X1.3 X1.4
VIN2: PS2.P$12(VIN) PS2.P$13(VIN) PS2.P$14(VIN) X2.1 X2.2 X2.3 X2.4
VIN-3.3V: C301.1 C302.1 X4.1
VIN-5.0V: C501.1 C502.1 X4.2
Unconnected: PS1.P$1(TRIM+) PS1.P$2 PS1.P$4(PG) PS1.P$5(TRIM-) PS1.P$6(DNC) PS1.P$9(/OFF) PS1.P$25(MECH1) PS1.P$26(MECH2) PS2.P$1(TRIM+) PS2.P$2 PS2.P$4(PG) PS2.P$5(TRIM-) PS2.P$6(DNC) PS2.P$9(/OFF) PS2.P$25(MECH1) PS2.P$26(MECH2) U1.A1 U1.A12 U1.M1 U1.M12 U2.A1 U2.A12 U2.M1 U2.M12 U3.A1 U3.A12 U3.M1 U3.M12 U4.A1 U4.A12 U4.M1 U4.M12 U5.A1 U5.A12 U5.M1 U5.M12 U6.A1 U6.A12 U6.M1 U6.M12 U7.A1 U7.A12 U7.M1 U7.M12 U8.A1 U8.A12 U8.M1 U8.M12

## Sheet 4 of 4
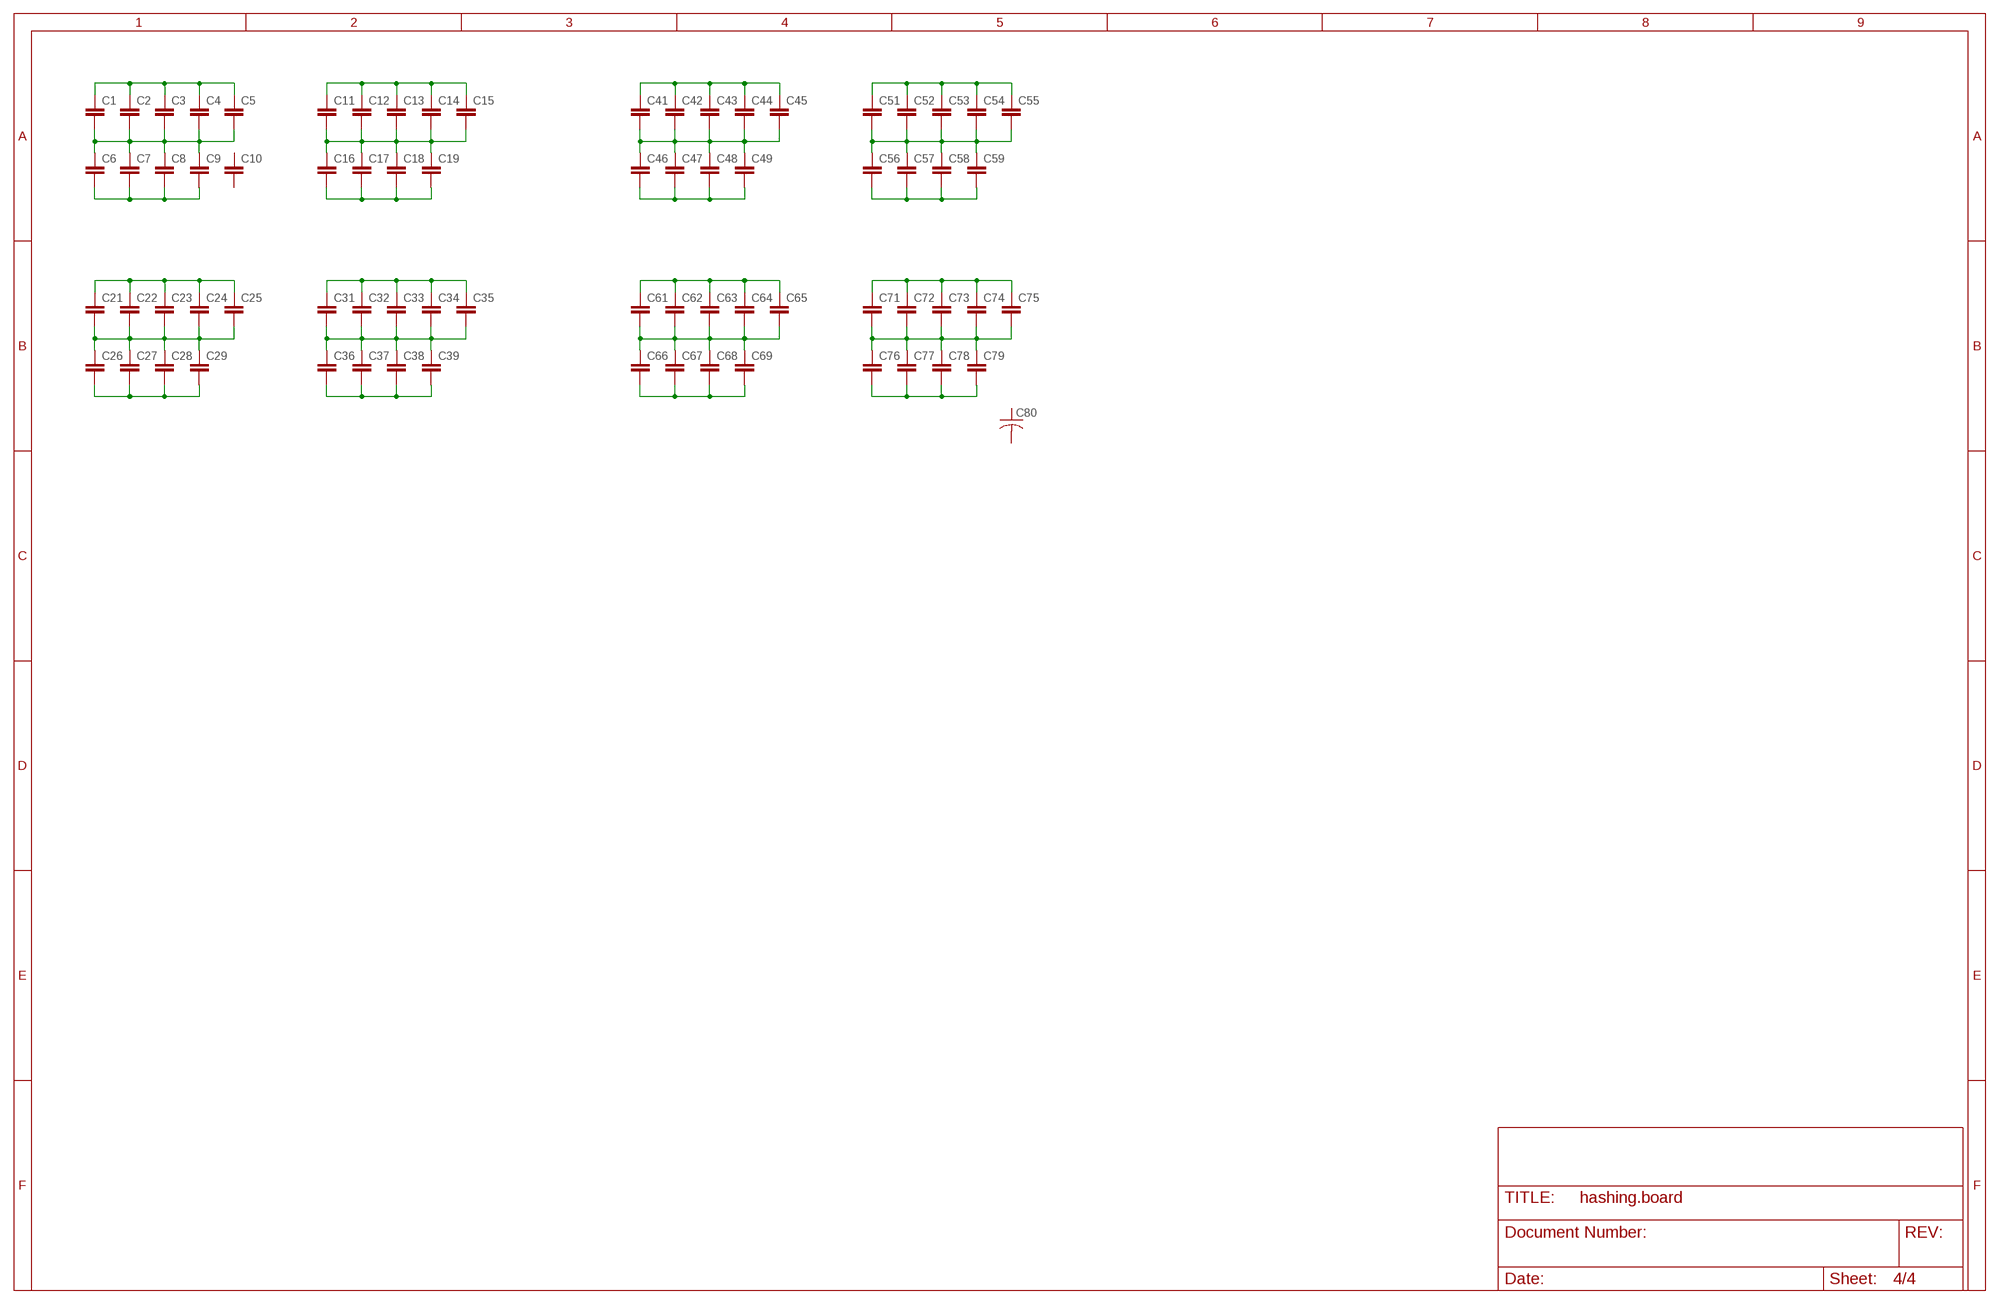
[diagram p3: schematic, sheet 4]

### Parts
C1  0306-REVERSE-GEO  [0306-REV-GEO]
C2  0306-REVERSE-GEO  [0306-REV-GEO]
C3  0306-REVERSE-GEO  [0306-REV-GEO]
C4  0306-REVERSE-GEO  [0306-REV-GEO]
C5  0306-REVERSE-GEO  [0306-REV-GEO]
C6  C-EUC0805  [C0805]
C7  C-EUC0402  [C0402]
C8  C-EUC0402  [C0402]
C9  C-EUC0402  [C0402]
C10  C-EUC0603  [C0603]
C11  C-EUC0402  [C0402]
C12  C-EUC0603K  [C0603K]
C13  C-EUC0603K  [C0603K]
C14  C-EUC0603  [C0603]
C15  C-EUC0603K  [C0603K]
C16  C-EUC0603K  [C0603K]
C17  C-EUC0603K  [C0603K]
C18  C-EUC0603K  [C0603K]
C19  C-EUC0603K  [C0603K]
C21  C-EUC0603K  [C0603K]
C22  C-EUC0603K  [C0603K]
C23  C-EUC0603K  [C0603K]
C24  C-EUC0603K  [C0603K]
C25  C-EUC0603K  [C0603K]
C26  C-EUC0603K  [C0603K]
C27  C-EUC0603K  [C0603K]
C28  C-EUC0603K  [C0603K]
C29  C-EUC0603K  [C0603K]
C31  C-EUC0603K  [C0603K]
C32  C-EUC0603K  [C0603K]
C33  C-EUC0603K  [C0603K]
C34  C-EUC0603K  [C0603K]
C35  C-EUC0603K  [C0603K]
C36  C-EUC0603K  [C0603K]
C37  C-EUC0603K  [C0603K]
C38  C-EUC0603K  [C0603K]
C39  C-EUC0603K  [C0603K]
C41  C-EUC0603K  [C0603K]
C42  C-EUC0603K  [C0603K]
C43  C-EUC0603K  [C0603K]
C44  C-EUC0603K  [C0603K]
C45  C-EUC0603K  [C0603K]
C46  C-EUC0603K  [C0603K]
C47  C-EUC0603K  [C0603K]
C48  C-EUC0603K  [C0603K]
C49  C-EUC0603K  [C0603K]
C51  C-EUC0603K  [C0603K]
C52  C-EUC0603K  [C0603K]
C53  C-EUC0603K  [C0603K]
C54  C-EUC0603K  [C0603K]
C55  C-EUC0603K  [C0603K]
C56  C-EUC0603K  [C0603K]
C57  C-EUC0603K  [C0603K]
C58  C-EUC0603K  [C0603K]
C59  C-EUC0603K  [C0603K]
C61  C-EUC0603K  [C0603K]
C62  C-EUC0603K  [C0603K]
C63  C-EUC0603K  [C0603K]
C64  C-EUC0603K  [C0603K]
C65  C-EUC0603K  [C0603K]
C66  C-EUC0603K  [C0603K]
C67  C-EUC0603K  [C0603K]
C68  C-EUC0603K  [C0603K]
C69  C-EUC0603K  [C0603K]
C71  C-EUC0603K  [C0603K]
C72  C-EUC0603K  [C0603K]
C73  C-EUC0603K  [C0603K]
C74  C-EUC0603K  [C0603K]
C75  C-EUC0603K  [C0603K]
C76  C-EUC0603K  [C0603K]
C77  C-EUC0603K  [C0603K]
C78  C-EUC0603K  [C0603K]
C79  C-EUC0603K  [C0603K]
C80  2917(7343M)  [2917(7343M)]

### Nets
GND: C1.P$1 C2.P$1 C3.P$1 C4.P$1 C5.P$1 C6.2 C7.2 C8.2 C9.2 C11.1 C12.1 C13.1 C14.1 C15.1 C16.2 C17.2 C18.2 C19.2 C21.1 C22.1 C23.1 C24.1 C25.1 C26.2 C27.2 C28.2 C29.2 C31.1 C32.1 C33.1 C34.1 C35.1 C36.2 C37.2 C38.2 C39.2 C41.1 C42.1 C43.1 C44.1 C45.1 C46.2 C47.2 C48.2 C49.2 C51.1 C52.1 C53.1 C54.1 C55.1 C56.2 C57.2 C58.2 C59.2 C61.1 C62.1 C63.1 C64.1 C65.1 C66.2 C67.2 C68.2 C69.2 C71.1 C72.1 C73.1 C74.1 C75.1 ; also sheet 1,2,3
N$14: C41.2 C42.2 C43.2 C44.2 C45.2 C46.1 C47.1 C48.1 C49.1
N$17: C51.2 C52.2 C53.2 C54.2 C55.2 C56.1 C57.1 C58.1 C59.1
N$20: C61.2 C62.2 C63.2 C64.2 C65.2 C66.1 C67.1 C68.1 C69.1
N$23: C71.2 C72.2 C73.2 C74.2 C75.2 C76.1 C77.1 C78.1 C79.1
N$24: C76.2 C77.2 C78.2 C79.2
VDD-1VA: C1.P$2 C2.P$2 C3.P$2 C4.P$2 C5.P$2 C6.1 C7.1 C8.1 C9.1 C11.2 C12.2 C13.2 C14.2 C15.2 C16.1 C17.1 C18.1 C19.1 C21.2 C22.2 C23.2 C24.2 C25.2 C26.1 C27.1 C28.1 C29.1 C31.2 C32.2 C33.2 C34.2 C35.2 C36.1 C37.1 C38.1 C39.1 ; also sheet 3
Unconnected: C10.1 C10.2 C80.P$1 C80.P$2

## Power pins joined to a net without a drawn wire
GND: U11.A3(GND) U11.A5(GND) U11.A7(GND) U11.B1(GND) U11.B3(GND) U11.B5(GND) U11.B7(GND) U11.B9(GND) U11.B11(GND) U11.C1(GND) U11.C3(GND) U11.C5(GND) U11.C7(GND) U11.C9(GND) U11.C11(GND) U11.D1(GND) U11.D3(GND) U11.D5(GND) U11.D7(GND) U11.D9(GND) U11.D11(GND) U11.E1(GND) U11.E3(GND) U11.E5(GND) U11.E7(GND) U11.E9(GND) U11.E11(GND) U11.F1(GND) U11.F3(GND) U11.F5(GND) U11.F7(GND) U11.F9(GND) U11.F11(GND) U11.G1(GND) U11.G3(GND) U11.G5(GND) U11.G7(GND) U11.G9(GND) U11.G11(GND) U11.H1(GND) U11.H3(GND) U11.H5(GND) U11.H7(GND) U11.H9(GND) U11.H11(GND) U11.J1(GND) U11.J3(GND) U11.J5(GND) U11.J7(GND) U11.J9(GND) U11.J11(GND) U11.K1(GND) U11.K3(GND) U11.K5(GND) U11.K7(GND) U11.K9(GND) U11.K11(GND) U11.L1(GND) U11.L3(GND) U11.L5(GND) U11.L7(GND) U11.L9(GND) U11.L11(GND) U11.M3(GND)
VDD: U11.A2(VDD) U11.A4(VDD) U11.A6(VDD) U11.A8(VDD) U11.A9(VDD) U11.A10(VDD) U11.B2(VDD) U11.B4(VDD) U11.B6(VDD) U11.B8(VDD) U11.B10(VDD) U11.C2(VDD) U11.C4(VDD) U11.C6(VDD) U11.C8(VDD) U11.C10(VDD) U11.D2(VDD) U11.D4(VDD) U11.D6(VDD) U11.D8(VDD) U11.D10(VDD) U11.E2(VDD) U11.E4(VDD) U11.E6(VDD) U11.E8(VDD) U11.E10(VDD) U11.F2(VDD) U11.F4(VDD) U11.F6(VDD) U11.F8(VDD) U11.F10(VDD) U11.G2(VDD) U11.G4(VDD) U11.G6(VDD) U11.G8(VDD) U11.G10(VDD) U11.H2(VDD) U11.H4(VDD) U11.H6(VDD) U11.H8(VDD) U11.H10(VDD) U11.J2(VDD) U11.J4(VDD) U11.J6(VDD) U11.J8(VDD) U11.J10(VDD) U11.K2(VDD) U11.K4(VDD) U11.K6(VDD) U11.K8(VDD) U11.K10(VDD) U11.L2(VDD) U11.L4(VDD) U11.L6(VDD) U11.L8(VDD) U11.L10(VDD) U11.M2(VDD) U11.M4(VDD) U11.M5(VDD) U11.M6(VDD) U11.M7(VDD)
VDD-IO-3V3: U11.A11(VDD-IO-3V3) U11.M10(VDD-IO-3V3)

## Library data of the parts
C1-C5 = CAPACITORS:0306-REVERSE-GEO: 0306 reverse geometry capacitor
C6-C19 C21-C29 C31-C39 C41-C49 C51-C59 C61-C69 C71-C79 C101-C117 C201-C210 C301 C302 C501 C502 = rcl:C-EU: CAPACITOR, European symbol
C80 = CAPACITORS:2917(7343M)
CA1-CA8 = casey's_custom_stuff:BFL-BGA-144-SPC
PS1 PS2 = custom.power:YV09T60
R1-R12 WHAT_VOLTAGE = rcl:R-US_: RESISTOR, American symbol
SV1 SV2 = con-lstb:MA05-2: PIN HEADER; OC_FARNELL: unknown; OC_NEWARK: unknown
U1-U8 = BFL.new:ASIC-1
U9 = Atmel_By_element14_Batch_1:AT32UC3A1256-AUT: 32-Bit Microcontroller; DESCRIPTION: 32-Bit Microcontroller; MPN: AT32UC3A1256-AUT; OC_FARNELL: 1841637; OC_NEWARK: 91R0756; PACKAGE: TQFP-100; SUPPLIER: Atmel Corporation
U10 = Altera_By_element14_Batch_1:EPM570GT100C5N: CPLD, MAX II; MPN: EPM570GT100C5N; OC_FARNELL: 1549469; OC_NEWARK: 51R9462; PACKAGE: TQFP-100; SUPPLIER: Altera
U11 = BFL.new:BFL-ASIC-1: BFL ASIC BGA-144 FIRST GENERATION
X1 X2 = con-molex:5566-8: Mini FIT connector 8 pol Source: http://www.molex.com; OC_FARNELL: unknown; OC_NEWARK: unknown
X3 = con-cypressindustries:MINI-USB-: MINI USB-B Conector Source: www.cypressindustries.com; OC_FARNELL: unknown; OC_NEWARK: unknown
X4 = con-molex:22-23-2031: .100" (2.54mm) Center Header - 3 Pin; MF: MOLEX; MPN: 22-23-2031; OC_FARNELL: 1462950; OC_NEWARK: 30C0862